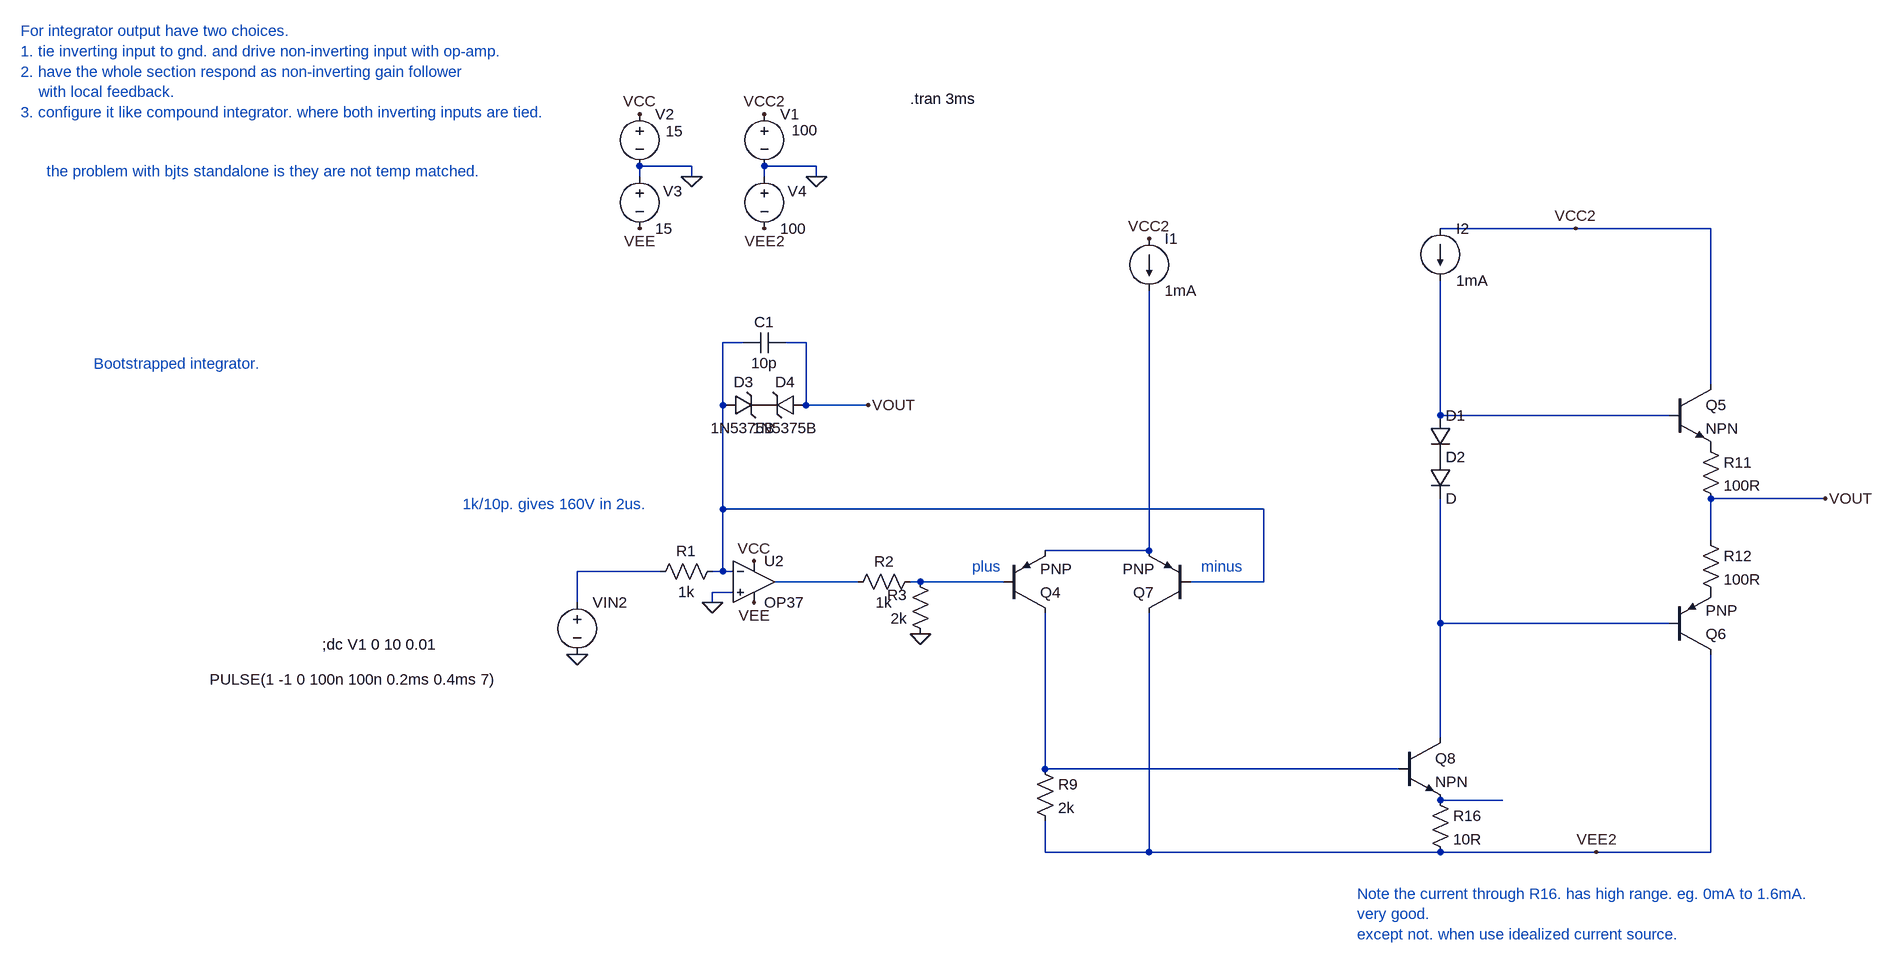
[diagram p0: schematic Draft45.asc]
Draft45.asc, the LTspice schematic file:
Version 4
SHEET 1 1508 952
WIRE -448 -288 -528 -288
WIRE -256 -288 -336 -288
WIRE -528 -272 -528 -288
WIRE -448 -272 -448 -288
WIRE -336 -272 -336 -288
WIRE -256 -272 -256 -288
WIRE 912 -192 704 -192
WIRE 1120 -192 912 -192
WIRE -368 -16 -400 -16
WIRE -272 -16 -304 -16
WIRE 1120 48 1120 -192
WIRE -400 80 -400 -16
WIRE -272 80 -272 -16
WIRE -176 80 -272 80
WIRE 704 96 704 -112
WIRE 1056 96 704 96
WIRE 1296 224 1120 224
WIRE -400 240 -400 80
WIRE 432 240 -400 240
WIRE 1120 288 1120 224
WIRE 256 304 256 -96
WIRE 256 304 96 304
WIRE -496 336 -624 336
WIRE -400 336 -400 240
WIRE -400 336 -416 336
WIRE -384 336 -400 336
WIRE -192 352 -320 352
WIRE -96 352 -112 352
WIRE 32 352 -96 352
WIRE 432 352 432 240
WIRE 432 352 320 352
WIRE -384 368 -416 368
WIRE -624 384 -624 336
WIRE -416 384 -416 368
WIRE 704 416 704 224
WIRE 1056 416 704 416
WIRE 704 592 704 416
WIRE 96 640 96 400
WIRE 640 640 96 640
WIRE 800 688 704 688
WIRE 96 768 96 720
WIRE 256 768 256 400
WIRE 256 768 96 768
WIRE 704 768 256 768
WIRE 944 768 704 768
WIRE 1120 768 1120 464
WIRE 1120 768 944 768
FLAG -256 -272 0
FLAG -336 -368 VCC2
FLAG -336 -192 VEE2
FLAG 912 -192 VCC2
FLAG 944 768 VEE2
FLAG 1296 224 VOUT
FLAG 256 -176 VCC2
FLAG -176 80 VOUT
FLAG -624 464 0
FLAG -416 384 0
FLAG -352 320 VCC
FLAG -352 384 VEE
FLAG -96 432 0
FLAG -448 -272 0
FLAG -528 -368 VCC
FLAG -528 -192 VEE
SYMBOL voltage -336 -384 R0
WINDOW 123 0 0 Left 0
WINDOW 39 0 0 Left 0
WINDOW 3 42 41 Left 2
SYMATTR Value 100
SYMATTR InstName V1
SYMBOL voltage -336 -288 R0
WINDOW 123 0 0 Left 0
WINDOW 39 0 0 Left 0
WINDOW 0 36 39 Left 2
SYMATTR InstName V4
SYMATTR Value 100
SYMBOL npn 1056 48 R0
SYMATTR InstName Q5
SYMBOL res 1104 128 R0
SYMATTR InstName R11
SYMATTR Value 100R
SYMBOL res 1104 272 R0
SYMATTR InstName R12
SYMATTR Value 100R
SYMBOL pnp 1056 464 M180
SYMATTR InstName Q6
SYMBOL res 80 624 R0
SYMATTR InstName R9
SYMATTR Value 2k
SYMBOL res 688 672 R0
SYMATTR InstName R16
SYMATTR Value 10R
SYMBOL pnp 32 400 M180
SYMATTR InstName Q4
SYMBOL pnp 320 400 R180
SYMATTR InstName Q7
SYMBOL npn 640 592 R0
SYMATTR InstName Q8
SYMBOL diode 688 96 R0
SYMATTR InstName D1
SYMBOL diode 688 160 R0
SYMATTR InstName D2
SYMBOL current 256 -176 R0
WINDOW 123 0 0 Left 0
WINDOW 39 0 0 Left 0
SYMATTR InstName I1
SYMATTR Value 1mA
SYMBOL current 704 -192 R0
WINDOW 123 0 0 Left 0
WINDOW 39 0 0 Left 0
SYMATTR InstName I2
SYMATTR Value 1mA
SYMBOL voltage -624 368 R0
WINDOW 123 0 0 Left 0
WINDOW 39 0 0 Left 0
WINDOW 3 -565 134 Left 2
SYMATTR Value PULSE(1 -1 0 100n 100n 0.2ms 0.4ms 7)
SYMATTR InstName VIN2
SYMBOL cap -304 -32 R90
WINDOW 0 0 32 VBottom 2
WINDOW 3 32 32 VTop 2
SYMATTR InstName C1
SYMATTR Value 10p
SYMBOL res -400 320 R90
WINDOW 0 0 56 VBottom 2
WINDOW 3 32 56 VTop 2
SYMATTR InstName R1
SYMATTR Value 1k
SYMBOL zener -400 96 R270
WINDOW 0 36 32 VTop 2
WINDOW 3 -4 32 VBottom 2
SYMATTR InstName D3
SYMATTR Value 1N5375B
SYMBOL zener -272 64 R90
WINDOW 0 -4 32 VBottom 2
WINDOW 3 36 32 VTop 2
SYMATTR InstName D4
SYMATTR Value 1N5375B
SYMBOL OpAmps\\OP37 -352 288 R0
SYMATTR InstName U2
SYMBOL res -96 336 R90
WINDOW 0 0 56 VBottom 2
WINDOW 3 32 56 VTop 2
SYMATTR InstName R2
SYMATTR Value 1k
SYMBOL res -80 448 R180
WINDOW 0 36 76 Left 2
WINDOW 3 36 40 Left 2
SYMATTR InstName R3
SYMATTR Value 2k
SYMBOL voltage -528 -384 R0
WINDOW 123 0 0 Left 0
WINDOW 39 0 0 Left 0
WINDOW 3 40 42 Left 2
SYMATTR Value 15
SYMATTR InstName V2
SYMBOL voltage -528 -288 R0
WINDOW 123 0 0 Left 0
WINDOW 39 0 0 Left 0
WINDOW 0 36 39 Left 2
SYMATTR InstName V3
SYMATTR Value 15
TEXT -112 -392 Left 2 !.tran 3ms
TEXT 336 328 Left 2 ;minus
TEXT -1440 -280 Left 2 ;the problem with bjts standalone is they are not temp matched.
TEXT 576 832 Left 2 ;Note the current through R16. has high range. eg. 0mA to 1.6mA.\nvery good.\nexcept not. when use idealized current source.
TEXT -1480 -496 Left 2 ;For integrator output have two choices.\n1. tie inverting input to gnd. and drive non-inverting input with op-amp.\n2. have the whole section respond as non-inverting gain follower\n    with local feedback.\n3. configure it like compound integrator. where both inverting inputs are tied.
TEXT -1016 448 Left 2 !;dc V1 0 10 0.01
TEXT -1368 16 Left 2 ;Bootstrapped integrator.
TEXT -800 232 Left 2 ;1k/10p. gives 160V in 2us.
TEXT -16 328 Left 2 ;plus

The netlist it stands for:
* Draft45.asc
V1 VCC2 0 100
V4 0 VEE2 100
Q5 VCC2 N002 P001 0 NPN
R11 P001 VOUT 100R
R12 VOUT P002 100R
Q6 VEE2 N007 P002 0 PNP
R9 N008 VEE2 2k
R16 N009 VEE2 10R
Q4 N008 N006 N003 0 PNP
Q7 VEE2 N001 N003 0 PNP
Q8 N007 N008 N009 0 NPN
D1 N002 P003 D
D2 P003 N007 D
I1 VCC2 N003 1mA
I2 VCC2 N002 1mA
VIN2 N004 0 PULSE(1 -1 0 100n 100n 0.2ms 0.4ms 7)
C1 VOUT N001 10p
R1 N001 N004 1k
D3 N001 P004 1N5375B
D4 VOUT P004 1N5375B
XU2 0 N001 VCC VEE N005 LT1037  ; OP37, pins In+ In- V+ V- OUT
R2 N006 N005 1k
R3 0 N006 2k
V2 VCC 0 15
V3 0 VEE 15
.model D D
.lib standard.dio
.model NPN NPN
.model PNP PNP
.lib standard.bjt
.tran 3ms
* minus
* the problem with bjts standalone is they are not temp matched.
* Note the current through R16. has high range. eg. 0mA to 1.6mA.
* very good.
* except not. when use idealized current source.
* For integrator output have two choices.
* 1. tie inverting input to gnd. and drive non-inverting input with op-amp.
* 2. have the whole section respond as non-inverting gain follower
*     with local feedback.
* 3. configure it like compound integrator. where both inverting inputs are tied.
;dc V1 0 10 0.01
* Bootstrapped integrator.
* 1k/10p. gives 160V in 2us.
* plus
.lib LTC.lib
.backanno
.end